# Altium project D_amplifier.PrjPcb (part 3 of 3)

## Sheet power_section.SchDoc
size 431 x 279 mm; Author: Pawel Bukowiec; Organization: ORGANIZATION; Address1: ADDRESS 1; Address2: ADDRESS 2; Address3: ADDRESS 3; Address4: ADDRESS 4; Revision: 1; SheetNumber: 4; SheetTotal: 5; ENG_APP_DATE: --/--/--; DSN_APP_DATE: --/--/--; CHK_APP_DATE: --/--/--; SPICEModelCacheJYBONEFT: <root> / <DocumentId>JYBONEFT</DocumentId> / <CacheFrame Number="0"> / <Model Name="driver_u8_s31" Kind="CKT"> / <Text>*$ / .subckt Driver_U8_S31 1 2 3 4 / S_U8_S31         3 4 1 2 _U8_S31 / RS_U8_S31         1 2 1G / .MODEL         _U8_S31 VSWITCH Roff=10e6 Ron=78m Voff=0.4 Von=1.1 / .ends Driver_U8_S31</Text> / </Model> / <Model Name="srlatchrhp" Kind="CKT"> / <Text>*$ / .SUBCKT SRLATCHRHP S R Q QB PARAMS: VDD=1 VSS=0 VTHRESH=0.5 / EQB 10 0 Value ={ IF( V(R) &gt; 0.6, 1,IF (  V(R)&lt; 0.6 &amp; V(Q)&gt;0.5 , 0 , 1)) } / EQ 20 0 Value ={ IF( V(R) &gt; 0.6, 0, IF ( V(S) &lt; 0.4 &amp; V(QB) &gt; 0.5 , 0 , 1)) } / RD1 10 QB 5 / CD1 QB 0 1E-9 IC = 1 / RD2 20 Q 5 / CD2 Q 0 1E-9 IC=0 / .ENDS SRLATCHRHP</Text> / </Model> / <Model Name="d_nideal" Kind="CKT"> / <Text>*$ / .subckt D_nideal 1 2 / d1 1 3 dd1 / vdc 2 3 1m / .model dd1 d / .ends D_nideal</Text> / </Model> / <Model Name="driver_u8_s4" Kind="CKT"> / <Text>*$ / .subckt Driver_U8_S4 1 2 3 4 / S_U8_S4         3 4 1 2 _U8_S4 / RS_U8_S4         1 2 1G / .MODEL         _U8_S4 VSWITCH Roff=1e6 Ron=2 Voff=0.2 Von=0.8 / .ends Driver_U8_S4</Text> / </Model> / <Model Name="inv_basic_gen" Kind="CKT"> / <Text>*$ / .SUBCKT INV_BASIC_GEN A  Y PARAMS: VDD=1 VSS=0 VTHRESH=0.5 / E_ABMGATE    YINT 0 VALUE {{IF(V(A) &gt; {VTHRESH} , / + {VSS},{VDD})}} / RINT YINT Y 1 / CINT Y 0 1n / .ENDS INV_BASIC_GEN</Text> / </Model> / <Model Name="and3_basic_gen" Kind="CKT"> / <Text>*$ / .SUBCKT AND3_BASIC_GEN A B C Y PARAMS: VDD=1 VSS=0 VTHRESH=0.5 / E_ABMGATE    YINT 0 VALUE {{IF(V(A) &gt; {VTHRESH}  &amp; / + V(B) &gt; {VTHRESH} &amp; / + V(C) &gt; {VTHRESH},{VDD},{VSS})}} / RINT YINT Y 1 / CINT Y 0 1n / .ENDS AND3_BASIC_GEN</Text> / </Model> / <Model Name="and4_basic_gen" Kind="CKT"> / <Text>*$ / .SUBCKT AND4_BASIC_GEN A B C D Y PARAMS: VDD=1 VSS=0 VTHRESH=0.5 / E_ABMGATE    YINT 0 VALUE {{IF(V(A) &gt; {VTHRESH}  &amp; / + V(B) &gt; {VTHRESH} &amp; / + V(C) &gt; {VTHRESH} &amp; / + V(D) &gt; {VTHRESH},{VDD},{VSS})}} / RINT YINT Y 1 / CINT Y 0 1n / .ENDS AND4_BASIC_GEN</Text> / </Model> / <Model Name="buf_delay_basic_gen" Kind="CKT"> / <Text>*$ / .SUBCKT BUF_DELAY_BASIC_GEN A  Y PARAMS: VDD=1 VSS=0 VTHRESH=0.5 DELAY = 10n / E_ABMGATE1    YINT1 0 VALUE {{IF(V(A) &gt; {VTHRESH} , / + {VDD},{VSS})}} / RINT YINT1 YINT2 1 / CINT YINT2 0 {DELAY*1.3} / E_ABMGATE2    YINT3 0 VALUE {{IF(V(YINT2) &gt; {VTHRESH} , / + {VDD},{VSS})}} / RINT2 YINT3 Y 1 / CINT2 Y 0 1n / .ENDS BUF_DELAY_BASIC_GEN</Text> / </Model> / <Model Name="driver_u8_s5" Kind="CKT"> / <Text>*$ / .subckt Driver_U8_S5 1 2 3 4 / S_U8_S5         3 4 1 2 _U8_S5 / RS_U8_S5         1 2 1G / .MODEL         _U8_S5 VSWITCH Roff=1e6 Ron=1.0 Voff=0.2 Von=0.8 / .ends Driver_U8_S5</Text> / </Model> / <Model Name="driver_u8_h2" Kind="CKT"> / <Text>*$ / .subckt Driver_U8_H2 1 2 3 4 / H_U8_H2         3 4 VH_U8_H2 1 / VH_U8_H2         1 2 0V / .ends Driver_U8_H2</Text> / </Model> / <Model Name="and2_basic_gen" Kind="CKT"> / <Text>*$ / .SUBCKT AND2_BASIC_GEN A B Y PARAMS: VDD=1 VSS=0 VTHRESH=0.5 / E_ABMGATE    YINT 0 VALUE {{IF(V(A) &gt; {VTHRESH}  &amp; / + V(B) &gt; {VTHRESH},{VDD},{VSS})}} / RINT YINT Y 1 / CINT Y 0 1n / .ENDS AND2_BASIC_GEN</Text> / </Model> / <Model Name="driver_u8_s30" Kind="CKT"> / <Text>*$ / .subckt Driver_U8_S30 1 2 3 4 / S_U8_S30         3 4 1 2 _U8_S30 / RS_U8_S30         1 2 1G / .MODEL         _U8_S30 VSWITCH Roff=10e6 Ron=148m Voff=0.4 Von=1.1 / .ends Driver_U8_S30</Text> / </Model> / <Model Name="mononeg_ps" Kind="CKT"> / <Text>*$ / .SUBCKT MONONEG_PS in Q Qn PARAMS: PW=1u / VS VSUP 0 DC 1 / GIN VSUP YA VALUE={IF(V(IN)&lt;0.5, V(VSUP)/1000K, 0)} / GDIS YA 0 VALUE={IF(V(IN)&lt;0.5,0, V(YA)/1m)} / CIN YA 0 1n IC=0 / RIN YA 0 1e11 / EABM1 YTD 0 VALUE={IF(V(YA)&gt; {PW*1000}, 0, 1)} / RYTD YTD 0 1e11 / EXOR P 0 VALUE={IF(V(YTD) &gt; 0.5 ^ V(IN) &gt; .5, 1, 0)} / ROUTpp2 P 0 1e11 / EAND1 Q1 0 VALUE={ IF(V(P)&gt;0.5 &amp; V(YTD)&gt;0.5, 1, 0)} / Ro1 Q1 Q 1m / Co1 Q 0 1p IC=0 / ROUT2 Q 0 1e11 / EAND2 Qn1 0 VALUE={ IF(V(Q)&gt;0.5, 0, 1)} / Ro2 Qn1 Qn 1m / Co2 Qn 0 1p / ROUT4 Qn 0 1e11 / .ENDS MONONEG_PS</Text> / </Model> / <Model Name="driver_u8_h1" Kind="CKT"> / <Text>*$ / .subckt Driver_U8_H1 1 2 3 4 / H_U8_H1         3 4 VH_U8_H1 1 / VH_U8_H1         1 2 0V / .ends Driver_U8_H1</Text> / </Model> / <Model Name="driver_u8_s6" Kind="CKT"> / <Text>*$ / .subckt Driver_U8_S6 1 2 3 4 / S_U8_S6         3 4 1 2 _U8_S6 / RS_U8_S6         1 2 1G / .MODEL         _U8_S6 VSWITCH Roff=1e6 Ron=2 Voff=0.2 Von=0.8 / .ends Driver_U8_S6</Text> / </Model> / <Model Name="or3_basic_gen" Kind="CKT"> / <Text>*$ / .SUBCKT OR3_BASIC_GEN A B C Y PARAMS: VDD=1 VSS=0 VTHRESH=0.5 / E_ABMGATE    YINT 0 VALUE {{IF(V(A) &gt; {VTHRESH}  | / + V(B) &gt; {VTHRESH} | / + V(C) &gt; {VTHRESH},{VDD},{VSS})}} / RINT YINT Y 1 / CINT Y 0 1n / .ENDS OR3_BASIC_GEN</Text> / </Model> / <Model Name="driver_u8_s7" Kind="CKT"> / <Text>*$ / .subckt Driver_U8_S7 1 2 3 4 / S_U8_S7         3 4 1 2 _U8_S7 / RS_U8_S7         1 2 1G / .MODEL         _U8_S7 VSWITCH Roff=1e6 Ron=1.0 Voff=0.2 Von=0.8 / .ends Driver_U8_S7</Text> / </Model> / <Model Name="driver_u8_s35" Kind="CKT"> / <Text>*$ / .subckt Driver_U8_S35 1 2 3 4 / S_U8_S35         3 4 1 2 _U8_S35 / RS_U8_S35         1 2 1G / .MODEL         _U8_S35 VSWITCH Roff=1000e6 Ron=1m Voff=0.2 Von=0.8 / .ends Driver_U8_S35</Text> / </Model> / <Model Name="or2_basic_gen" Kind="CKT"> / <Text>*$ / .SUBCKT OR2_BASIC_GEN A B Y PARAMS: VDD=1 VSS=0 VTHRESH=0.5 / E_ABMGATE    YINT 0 VALUE {{IF(V(A) &gt; {VTHRESH}  | / + V(B) &gt; {VTHRESH},{VDD},{VSS})}} / RINT YINT Y 1 / CINT Y 0 1n / .ENDS OR2_BASIC_GEN</Text> / </Model> / <Model Name="inv_delay_basic_gen" Kind="CKT"> / <Text>*$ / .SUBCKT INV_DELAY_BASIC_GEN A  Y PARAMS: VDD=1 VSS=0 VTHRESH=0.5 DELAY = 10n / E_ABMGATE1    YINT1 0 VALUE {{IF(V(A) &gt; {VTHRESH} , / + {VDD},{VSS})}} / RINT YINT1 YINT2 1 / CINT YINT2 0 {DELAY*1.443} / E_ABMGATE2    YINT3 0 VALUE {{IF(V(YINT2) &gt; {VTHRESH} , / + {VSS},{VDD})}} / RINT2 YINT3 Y 1 / CINT2 Y 0 1n / .ENDS INV_DELAY_BASIC_GEN</Text> / </Model> / <Model Name="d_d1" Kind="MDL"> / <Text>*$ / .model D_D1 d / + is=1e-015 / + tt=1e-011 / + rs=0.05 / + n=0.1</Text> / </Model> / <Model Name="dff_r" Kind="CKT"> / <Text>*$ / .SUBCKT DFF_R Q QB CLK D R PARAMS: VDD=1 VSS=0 VTHRESH=0.5 / X1 CLK CLKdel INV_DELAY_BASIC_GEN PARAMS: VDD={VDD} VSS={VSS} VTHRESH={VTHRESH} DELAY = 15n / X2 CLK CLKdel CLKint AND2_BASIC_GEN PARAMS: VDD={VDD} VSS={VSS} VTHRESH={VTHRESH} / GQ 0 Qint VALUE = {IF(V(R) &gt; {VTHRESH},-5,IF(V(CLKint)&gt; {VTHRESH}, / + IF(V(D)&gt; {VTHRESH},5,-5),0))} / CQint Qint 0 1n / RQint Qint 0 1000MEG / D_D10 Qint MY5 D_D1 / V1 MY5 0 {VDD} / D_D11 MYVSS Qint D_D1 / V2 MYVSS 0 {VSS} / EQ Qqq 0 Qint 0 1 / X3 Qqq Qqqd1 BUF_DELAY_BASIC_GEN PARAMS: VDD={VDD} VSS={VSS} VTHRESH={VTHRESH} DELAY = 20n / RQq Qqqd1 Q 1 / EQb Qbr 0 VALUE = {IF( V(Q) &gt; {VTHRESH}, {VSS},{VDD})} / RQb Qbr Qb 1 / Cdummy1 Q 0 1nF / Cdummy2 QB 0 1nF / .IC V(Qint) {VSS} / .ENDS DFF_R</Text> / <Dependency>0\inv_delay_basic_gen</Dependency> / <Dependency>0\and2_basic_gen</Dependency> / <Dependency>0\buf_delay_basic_gen</Dependency> / <Dependency>0\d_d1</Dependency> / </Model> / <Model Name="comp_basic_gen" Kind="CKT"> / <Text>*$ / .SUBCKT COMP_BASIC_GEN INP INM Y PARAMS: VDD=1 VSS=0 VTHRESH=0.5 / E_ABM Yint 0 VALUE {IF (V(INP) &gt; / + V(INM), {VDD},{VSS})} / R1 Yint Y 1 / C1 Y 0 1n / .ENDS COMP_BASIC_GEN</Text> / </Model> / <Model Name="comphys_basic_gen" Kind="CKT"> / <Text>*$ / .SUBCKT COMPHYS_BASIC_GEN INP INM HYS OUT PARAMS: VDD=5 VSS=0 VTHRESH=2.5 / EIN INP1 INM1 INP INM 1 / EHYS INP1 INP2 VALUE { IF( V(1) &gt; {VTHRESH},-V(HYS),0) } / EOUT OUT 0 VALUE { IF( V(INP2)&gt;V(INM1), {VDD} ,{VSS}) } / R1 OUT 1 1 / C1 1 0 5n / RINP1 INP1 0 1K / .ENDS COMPHYS_BASIC_GEN</Text> / </Model> / <Model Name="d_d2" Kind="MDL"> / <Text>*$ / .model D_D2 d / + is=1e-015 / + n=0.1 / + tt=1e-011</Text> / </Model> / <Model Name="hiccup_u10_s5" Kind="CKT"> / <Text>*$ / .subckt Hiccup_U10_S5 1 2 3 4 / S_U10_S5         3 4 1 2 _U10_S5 / RS_U10_S5         1 2 1G / .MODEL         _U10_S5 VSWITCH Roff=1e9 Ron=1.0m Voff=0.25 Von=0.75 / .ends Hiccup_U10_S5</Text> / </Model> / <Model Name="hiccup_u10_s2" Kind="CKT"> / <Text>*$ / .subckt Hiccup_U10_S2 1 2 3 4 / S_U10_S2         3 4 1 2 _U10_S2 / RS_U10_S2         1 2 1G / .MODEL         _U10_S2 VSWITCH Roff=1e6 Ron=1.0 Voff=0.25 Von=0.75 / .ends Hiccup_U10_S2</Text> / </Model> / <Model Name="hiccup_u10_s36" Kind="CKT"> / <Text>*$ / .subckt Hiccup_U10_S36 1 2 3 4 / S_U10_S36         3 4 1 2 _U10_S36 / RS_U10_S36         1 2 1G / .MODEL         _U10_S36 VSWITCH Roff=1G Ron=1.0m Voff=0.2V Von=0.8V / .ends Hiccup_U10_S36</Text> / </Model> / <Model Name="mux2_basic_gen" Kind="CKT"> / <Text>*$ / .SUBCKT MUX2_BASIC_GEN A B S Y PARAMS: VDD=1 VSS=0 VTHRESH=0.5 / E_ABMGATE  YINT 0 VALUE {{IF(V(S) &gt; {VTHRESH}, / + V(B),V(A))}} / RINT YINT Y 1 / CINT Y 0 1n / .ENDS MUX2_BASIC_GEN</Text> / </Model> / <Model Name="oscillator_u3_s26" Kind="CKT"> / <Text>*$ / .subckt Oscillator_U3_S26 1 2 3 4 / S_U3_S26         3 4 1 2 _U3_S26 / RS_U3_S26         1 2 1G / .MODEL         _U3_S26 VSWITCH Roff=100e6 Ron=100m Voff=0.2 Von=0.8 / .ends Oscillator_U3_S26</Text> / </Model> / <Model Name="erroramp_u5_s2" Kind="CKT"> / <Text>*$ / .subckt ErrorAmp_U5_S2 1 2 3 4 / S_U5_S2         3 4 1 2 _U5_S2 / RS_U5_S2         1 2 1G / .MODEL         _U5_S2 VSWITCH Roff=1e9 Ron=1m Voff=0.2 Von=0.5 / .ends ErrorAmp_U5_S2</Text> / </Model> / <Model Name="d_d" Kind="MDL"> / <Text>*$ / .model D_D d / + is=1e-015 / + n=0.01m / + tt=1e-011</Text> / </Model> / <Model Name="softstart_u4_s68" Kind="CKT"> / <Text>*$ / .subckt SoftStart_U4_S68 1 2 3 4 / S_U4_S68         3 4 1 2 _U4_S68 / RS_U4_S68         1 2 1G / .MODEL         _U4_S68 VSWITCH Roff=100e6 Ron=3571 Voff=0.2 Von=0.8 / .ends SoftStart_U4_S68</Text> / </Model> / <Model Name="buf_basic_gen" Kind="CKT"> / <Text>*$ / .SUBCKT BUF_BASIC_GEN A  Y PARAMS: VDD=1 VSS=0 VTHRESH=0.5 / E_ABMGATE    YINT 0 VALUE {{IF(V(A) &gt; {VTHRESH} , / + {VDD},{VSS})}} / RINT YINT Y 1 / CINT Y 0 1n / .ENDS BUF_BASIC_GEN</Text> / </Model> / <Model Name="dffsbrb_rhpbasic_gen" Kind="CKT"> / <Text>*$ / .subckt dffsbrb_rhpbasic_gen q qb clk d rb sb params: vdd=1 vss=0 vthresh=0.5 / x1 clk clkdel inv_delay_basic_gen params: vdd={vdd} vss={vss} vthresh= / + {vthresh} delay = 15n / x2 clk clkdel clkint and2_basic_gen params: vdd={vdd} vss={vss} vthresh= / + {vthresh} / gq 0 qint value = {if(v(rb) &lt; {vthresh},-5,if(v(sb)&lt; {vthresh},5, / +  if(v(clkint)&gt; {vthresh}, / + if(v(d)&gt; {vthresh},5,-5),0)))} / cqint qint 0 1n / rqint qint 0 1000meg / d_d10 qint my5 d_d1 / v1 my5 0 5 / d_d11 0 qint d_d1 / eq qqq 0 qint 0 1 / x3 qqq qqqd1 buf_delay_basic_gen params: vdd={vdd} vss={vss} vthresh={vthresh} / +  delay = 20n / rqq qqqd1 q 1 / eqb qbr 0 value = {if( v(q) &gt; {vthresh}, {vss},{vdd})} / rqb qbr qb 1 / cdummy1 q 0 1nf / cdummy2 qb 0 1nf / .ic v(qint) {vss} / .model d_d1 d / + is=1e-015 / + tt=1e-011 / + rs=0.05 / + n=0.1 / .ends dffsbrb_rhpbasic_gen</Text> / <Dependency>0\inv_delay_basic_gen</Dependency> / <Dependency>0\and2_basic_gen</Dependency> / <Dependency>0\buf_delay_basic_gen</Dependency> / </Model> / <Model Name="gmiphase_u6_s2" Kind="CKT"> / <Text>*$ / .subckt GmIphase_U6_S2 1 2 3 4 / S_U6_S2         3 4 1 2 _U6_S2 / RS_U6_S2         1 2 1G / .MODEL         _U6_S2 VSWITCH Roff=1e9 Ron=1.0m Voff=0.25 Von=0.75 / .ends GmIphase_U6_S2</Text> / </Model> / <Model Name="tps54202h_trans" Kind="CKT"> / <Text>*$ / *TPS54202H / ***************************************************************************** / * (C) Copyright 2016 Texas Instruments Incorporated. All rights reserved. / ***************************************************************************** / ** This model is designed as an aid for customers of Texas Instruments. / ** TI and its licensors and suppliers make no warranties, either expressed / ** or implied, with respect to this model, including the warranties of / ** merchantability or fitness for a particular purpose.  The model is / ** provided solely on an "as is" basis.  The entire risk as to its quality / ** and performance is with the customer / ***************************************************************************** / * / * This model is subject to change without notice. Texas Instruments / * Incorporated is not responsible for updating this model. / * / ***************************************************************************** / * / ** Released by: WEBENCH Design Center, Texas Instruments Inc. / * Part: TPS54202H / * Date: 19APR2016 / * Model Type:  TRANSIENT / * Simulator: PSPICE / * Simulator Version: 16.2.0.p001 / * EVM Order Number: NA / * EVM Users Guide: NA / * Datasheet: NA / * / * Model Version: Final 1.00 / * / ***************************************************************************** / * / * Updates: / * / * Final 1.00 / * Release to Web. / * / ***************************************************************************** / * / * Model Usage Notes: / * / * 1. All the features mentioned in the datasheet have been modelled except / *      a. Thermal behaviour / * / * / ***************************************************************************** / .SUBCKT TPS54202H_TRANS BOOT EN GND PH VIN VSENSE PARAMS: STEADY_STATE=0 / R_U8_R245         0 BOOT  10Meg / X_U8_S31    LDRV 0 PH U8_N16881733 Driver_U8_S31 / C_U8_C78         U8_N16881752 0  1.443n / E_U8_ABM170         U8_N16882064 0 VALUE { {IF(V(LDRV) &gt; 1.1,0,1)}    } / X_U8_S4    LDRVIN 0 U8_N16881594 LDRV Driver_U8_S4 / X_U8_U621         PWM_FINAL U8_N16881765 INV_BASIC_GEN PARAMS: VDD=1 VSS=0 / +  VTHRESH=500E-3 / X_U8_U619         U8_SDWN_N PWM_FINAL U8_N16882062 HDRVIN AND3_BASIC_GEN / +  PARAMS: VDD=1 VSS=0 VTHRESH=500E-3 / E_U8_ABM79         U8_N16881756 0 VALUE { {IF((V(HDRV) - V(PH)) &gt; 1.1,0,1)} / +  } / X_U8_U613         SDWN U8_SDWN_N INV_BASIC_GEN PARAMS: VDD=1 VSS=0 / +  VTHRESH=500E-3 / X_U8_S5    U8_N16881411 0 LDRV 0 Driver_U8_S5 / X_U8_U622         U8_SDWN_N U8_N16881765 OCLOWLIMIT U8_N16881752 U8_BOOT_ON / +  AND4_BASIC_GEN PARAMS: VDD=1 VSS=0 VTHRESH=500E-3 / C_U8_C77         U8_N16882062 0  1.443n / R_U8_R143         U8_N16882064 U8_N16882062  35 / X_U8_H2    U8_N16881733 0 OCLOW 0 Driver_U8_H2 / V_U8_V49         U8_N16881594 0 5 / X_U8_D15         PH U8_N16881320 D_nideal / X_U8_U827         U8_BOOT_ON PBIAS LDRVIN AND2_BASIC_GEN PARAMS: VDD=1 VSS=0 / +  VTHRESH=500E-3 / E_U8_ABM167         U8_N16881692 0 VALUE { {IF((V(BOOT) - V(PH)) &lt; 2.1,0,1)} / +  } / C_U8_C140         0 BOOT_UVLO  1n / X_U8_S30    HDRV PH U8_N16881320 PH Driver_U8_S30 / X_U8_U617         HDRVIN U8_N16881438 INV_BASIC_GEN PARAMS: VDD=1 VSS=0 / +  VTHRESH=500E-3 / X_U8_H1    VIN U8_N16881320 ISW 0 Driver_U8_H1 / X_U8_S6    HDRVIN 0 BOOT HDRV Driver_U8_S6 / R_U8_R144         U8_N16881756 U8_N16881752  35 / X_U8_S7    U8_N16881438 0 HDRV PH Driver_U8_S7 / X_U8_D16         U8_N16881733 PH D_nideal / X_U8_S35    U8_BOOT_ON 0 VIN BOOT Driver_U8_S35 / R_U8_R244         U8_N16881692 BOOT_UVLO  1 / X_U8_U616         LDRVIN U8_N16881411 INV_BASIC_GEN PARAMS: VDD=1 VSS=0 / +  VTHRESH=500E-3 / X_U12_U613         U12_N16779597 HDRV U12_VALLEY_ILIMIT OR2_BASIC_GEN PARAMS: / +  VDD=1 VSS=0 VTHRESH=500E-3 / E_U12_ABM154         U12_N16766365 0 VALUE { IF(V(SS_TR)&lt;30m,1,V(HDRVIN))    } / X_U12_U646         OCLOWLIMIT U12_N16760921 U12_N16760925 U12_SET1 / +  U12_N16760761 DFF_R PARAMS:  VDD=1 VSS=0 VTHRESH=0.5 / X_U12_U647         SYSCLK U12_N16766365 U12_N16760925 AND2_BASIC_GEN PARAMS: / +  VDD=1 VSS=0 VTHRESH=500E-3 / V_U12_V84         U12_SET1 0 1 / R_U12_R3         0 U12_N16760921  10k / X_U12_U605         U12_N16779389 ISW U12_CBC_ILIMIT COMP_BASIC_GEN PARAMS: / +  VDD=1 VSS=0 VTHRESH=0.5 / E_U12_ABM153         U12_N16775618 0 VALUE { {IF(V(LDRVIN) &gt; 0.5, {IF(V(OCLOW) / +  &gt; -50m,1,0)},0)}    } / X_U12_U621         U12_CBC_ILIMIT U12_VALLEY_ILIMIT U12_N16779301 ILIM / +  AND3_BASIC_GEN PARAMS: VDD=1 VSS=0 VTHRESH=500E-3 / R_U12_R2         U12_N16775618 U12_N16760761  1 / X_U12_U611         OCLOW U12_N16779415 U12_N16779597 COMP_BASIC_GEN PARAMS: / +  VDD=1 VSS=0 VTHRESH=0.5 / X_U12_U620         HICCUP U12_N16779301 INV_BASIC_GEN PARAMS: VDD=1 VSS=0 / +  VTHRESH=500E-3 / C_U12_C2         U12_N16760761 0  1n / V_U12_VOCLLM         U12_N16779415 0 -3.2 / V_U12_VOCHLM         U12_N16779389 0 3.4 / X_U11_U136         U11_N16496294 U11_N6045102 SDWN OR2_BASIC_GEN PARAMS: VDD=1 / +  VSS=0 VTHRESH=500E-3 / X_U11_U2         EN U11_N16640225 U11_N166402810 U11_ENAB COMPHYS_BASIC_GEN / +  PARAMS: VDD=1 VSS=0 VTHRESH=0.5 / V_U11_V64         U11_N16643747 0 4.2 / D_U11_D12         0 EN D_D2 / V_U11_V66         U11_N16655865 0 6.5V / G_U11_ABMII1         VIN EN VALUE { {0+ 1.1u*V(U11_ENAB)}    } / V_U11_V65         U11_N16642234 0 0.5 / X_U11_U605         U11_ENAB U11_N16496294 INV_BASIC_GEN PARAMS: VDD=1 VSS=0 / +  VTHRESH=500E-3 / X_U11_U604         U11_N166419402 U11_N6045102 INV_BASIC_GEN PARAMS: VDD=1 / +  VSS=0 VTHRESH=500E-3 / X_U11_U3         VIN U11_N16643747 U11_N16642234 U11_N166419402 / +  COMPHYS_BASIC_GEN PARAMS: VDD=1 VSS=0 VTHRESH=0.5 / R_U11_R257         0 EN  1Meg / V_U11_V1         U11_N166402810 0 0.3Vdc / D_U11_D11         EN U11_N16655865 D_D2 / V_U11_V2         U11_N16640225 0 1.28Vdc / D_U11_D9         EN VIN D_D2 / G_U10_G5         0 U10_N16878554 U10_500N 0 1 / G_U10_G3         0 U10_N16864691 U10_OUT2 0 1 / X_U10_U652         U10_N16864713 U10_N16864533 INV_BASIC_GEN PARAMS: VDD=1 / +  VSS=0 VTHRESH=500E-3 / X_U10_S5    U10_N16878651 0 U10_N16878554 0 Hiccup_U10_S5 / V_U10_V48         U10_N16854825 0 12 / X_U10_U614         U10_N16864713 SYSCLK U10_HICCUP_N U10_OUT1 AND3_BASIC_GEN / +  PARAMS: VDD=1 VSS=0 VTHRESH=500E-3 / D_U10_D14         U10_H_CHECK U10_N16854825 D_D2 / C_U10_C1         0 U10_N16864691  500n IC=0 / X_U10_U650         SYSCLK U10_500N N16878734 MONONEG_PS PARAMS: PW=500N / X_U10_S2    U10_N16864770 0 U10_N16864691 0 Hiccup_U10_S2 / X_U10_U615         U10_N16864543 U10_N16864560 U10_N16864770 OR2_BASIC_GEN / +  PARAMS: VDD=1 VSS=0 VTHRESH=500E-3 / I_U10_I3         U10_N16854825 U10_H_CHECK DC 5u / X_U10_U622         U10_CLR_HICCUP U10_N16880073 U10_N16864560 OR2_BASIC_GEN / +  PARAMS: VDD=1 VSS=0 VTHRESH=500E-3 / X_U10_U607         HICCUP U10_N16864664 INV_DELAY_BASIC_GEN PARAMS: VDD=1 VSS=0 / +  VTHRESH=0.5 DELAY=10u / X_U10_U613         SDWN U10_H_END U10_N16864651 OR2_BASIC_GEN PARAMS: VDD=1 / +  VSS=0 VTHRESH=500E-3 / X_U10_S36    U10_N16854816 0 U10_H_CHECK 0 Hiccup_U10_S36 / X_U10_U608         HICCUP U10_N16864664 U10_N16864552 AND2_BASIC_GEN PARAMS: / +  VDD=1 VSS=0 VTHRESH=500E-3 / X_U10_U617         U10_N16864604 U10_N16864552 U10_N16880073 OR2_BASIC_GEN / +  PARAMS: VDD=1 VSS=0 VTHRESH=500E-3 / V_U10_V2         U10_N16864680 0 512 / R_U10_R4         U10_N16864713 U10_N16864539  8k / X_U10_U625         U10_N16878554 U10_N16878597 U10_CLR_HICCUP COMP_BASIC_GEN / +  PARAMS: VDD=1 VSS=0 VTHRESH=0.5 / X_U10_U618         HICCUP U10_N16854816 INV_DELAY_BASIC_GEN PARAMS: VDD=1 VSS=0 / +  VTHRESH=0.5 DELAY=20n / X_U10_U609         U10_N16864691 U10_N16864680 U10_N16864671 COMP_BASIC_GEN / +  PARAMS: VDD=1 VSS=0 VTHRESH=0.5 / C_U10_C5         U10_N16864539 0  1.443n / E_U10_ABM171         U10_N16878651 0 VALUE { if(v(HDRVIN) &gt;0.5 , 0 , 1 )    } / X_U10_U616         U10_N16864539 U10_N16864533 U10_N16864543 AND2_BASIC_GEN / +  PARAMS: VDD=1 VSS=0 VTHRESH=500E-3 / D_U10_D15         U10_N16878554 U10_N16878590 D_D2 / C_U10_C83         U10_H_CHECK 0  1.6384E-08 IC=0 / D_U10_D10         U10_N16864691 U10_N16864688 D_D2 / X_U10_U619         U10_H_CHECK U10_N16855026 U10_N16854953 COMP_BASIC_GEN / +  PARAMS: VDD=1 VSS=0 VTHRESH=0.5 / X_U10_U30         U10_N16864671 U10_N16864651 HICCUP U10_HICCUP_N SRLATCHRHP / +  PARAMS: VDD=1 VSS=0 VTHRESH=0.5 / V_U10_V5         U10_N16864604 0 / +PULSE {STEADY_STATE} 0 0 1n 1n 200u 1 / E_U10_ABM1         U10_N16864713 0 VALUE { IF( V(OCB) &gt; 0.5 , 1 , 0 )    } / V_U10_V9         U10_N16878590 0 5 / X_U10_U620         U10_N16854953 U10_N16854955 U10_H_END AND2_BASIC_GEN PARAMS: / +  VDD=1 VSS=0 VTHRESH=500E-3 / V_U10_V1         U10_N16864688 0 515 / V_U10_V10         U10_N16878597 0 3.98 / X_U10_U621         U10_N16854953 U10_N16854955 INV_DELAY_BASIC_GEN PARAMS: / +  VDD=1 VSS=0 VTHRESH=0.5 DELAY=10u / C_U10_C3         0 U10_N16878554  500n IC=0 / V_U10_V6         U10_N16855026 0 10 / X_U10_U648         U10_OUT1 U10_OUT2 N16864942 MONONEG_PS PARAMS: PW=500N / R_R275         VSENSE VSENSE_INT  400k / C_C12         0 VSENSE_INT  2p / X_U3_U137         U3_CLK_500K U3_ULQ_CLK ULQ_MODE SYSCLK MUX2_BASIC_GEN PARAMS: / +  VDD=1 VSS=0 VTHRESH=0.5 / D_U3_D11         RAMP U3_N16804971 D_D2 / V_U3_V45         U3_N16804971 0 5 / V_U3_V47         U3_ULQ_CLK 0 / +PULSE 0 1 0 1n 1n 12.5u 25u / C_U3_C1         0 U3_BLANK  1.443n / V_U3_VRAMP_MAX         U3_N16692390 0 1.4 / X_U3_U135         U3_CLK_500K U3_N16810628 BUF_DELAY_BASIC_GEN PARAMS: VDD=1 / +  VSS=0 VTHRESH=0.5 DELAY=20n / X_U3_U131         RAMP U3_N16692390 U3_CLK_500K COMP_BASIC_GEN PARAMS: VDD=1 / +  VSS=0 VTHRESH=0.5 / D_U3_D12         U3_N16817384 U3_BLANK D_D2 / X_U3_S26    U3_N16807586 0 RAMP 0 Oscillator_U3_S26 / E_U3_E1         U3_N16817384 0 ULQ_MODE 0 1 / G_U3_ABMII1         U3_N16804971 RAMP VALUE { V(0) + 5u    } / X_U3_U136         SDWN U3_BLANK U3_N16810628 U3_N16807586 OR3_BASIC_GEN PARAMS: / +  VDD=1 VSS=0 VTHRESH=500E-3 / C_U3_CRAMP         RAMP 0  7.143p / R_U3_R1         U3_N16817384 U3_BLANK  1k / C_U5_C8         0 N16888001  2p / R_U5_R6         U5_N16755015 N16888001  15k / V_U5_Vupper_CLMP         U5_N16757488 0 2.3 / C_U5_C11         0 OCB  1n / X_U5_S2    ULQ_MODE 0 N16888001 U5_N16739044 ErrorAmp_U5_S2 / C_U5_C7         0 U5_N16739044  18p / D_U5_D10         N16888001 U5_N16757488 D_D / R_U5_Ro         0 N16888001  4MEG / E_U5_ABM10         U5_TAIL_CUR 0 VALUE { {IF(V(ULQ_MODE) &gt; 0.5 , 2u , 40u)} / +  } / D_U5_D9         U5_LOW_CLMP N16888001 D_D / R_U5_R12         U5_N7406885 OCB  1 / G_U5_ABM2I3         U5_N16755015 0 VALUE { / +  LIMIT((V(U5_N16755015)-V(U5_N16739044))*66u , -V(U5_GM), V(U5_GM) )    } / R_U5_R274         U5_N16739044 U5_N16755015  1.875Meg / E_U5_ABM8         U5_N7406885 0 VALUE { {IF(V(N16888001) &gt; 1.75,5,0)}    } / E_U5_ABM9         U5_LOW_CLMP 0 VALUE { {IF(V(SDWN) &gt; 0.5,0,0.439)}    } / G_U5_ABM2I1         0 N16888001 VALUE { {LIMIT((V(VREF_GM) - / +  V(VSENSE_INT))*200u, -V(U5_TAIL_CUR),V(U5_TAIL_CUR))}    } / E_U5_ABM169         U5_GM 0 VALUE { {IF(V(ULQ_MODE) &gt; 0.5 , 0 , 20u)}    } / X_U4_U825         SDWN OCB HICCUP U4_N16681297 OR3_BASIC_GEN PARAMS: VDD=1 / +  VSS=0 VTHRESH=500E-3 / G_U4_ABMII1         U4_N7397984 SS_TR VALUE { {IF(V(U4_N16678220) &gt; / +  0.5,0.18u,0)}    } / V_U4_V70         U4_N7397984 0 1.7 / R_U4_R15         U4_N16681297 U4_N16681349  100 / X_U4_S68    U4_N16681349 0 SS_TR U4_N16681263 SoftStart_U4_S68 / V_U4_V72         U4_N16681263 0 -0.1mVdc / X_U4_U827         U4_HICCUP_N U4_N16661855 U4_N16678220 AND2_BASIC_GEN PARAMS: / +  VDD=1 VSS=0 VTHRESH=500E-3 / D_U4_D63         0 SS_TR D_D2 / E_U4_ABM174         VREF_GM 0 VALUE { IF( {STEADY_STATE} &gt; 0.5, 0.6, / +  IF(V(SS_TR) &lt; 600m, V(SS_TR),600m))    } / C_U4_C15         0 U4_N16681349  1.443n / X_U4_U1         SDWN U4_N16661855 INV_BASIC_GEN PARAMS: VDD=1 VSS=0 / +  VTHRESH=500E-3 / D_U4_D62         SS_TR U4_N7397984 D_D2 / X_U4_U2         HICCUP U4_HICCUP_N INV_BASIC_GEN PARAMS: VDD=1 VSS=0 / +  VTHRESH=500E-3 / C_U4_C9         SS_TR 0  1.5n IC={1.7*STEADY_STATE} / V_V1         N16888001 COMP 0Vdc / X_U6_U823         U6_N17090706 U6_PWM_CLK U6_N17026806 AND2_BASIC_GEN PARAMS: / +  VDD=1 VSS=0 VTHRESH=500E-3 / D_U6_D59         U6_DISABLE U6_N17027128 D_D2 / V_U6_V85         U6_N17027150 VSENSE_INT 10m / X_U6_U828         U6_N17096258 SYSCLK U6_N17108478 AND2_BASIC_GEN PARAMS: VDD=1 / +  VSS=0 VTHRESH=500E-3 / X_U6_U630         COMP U6_N17162707 U6_N17152306 COMP_BASIC_GEN PARAMS: VDD=1 / +  VSS=0 VTHRESH=0.5 / X_U6_U612         U6_N17026579 VSENSE_INT PBIAS COMP_BASIC_GEN PARAMS: VDD=1 / +  VSS=0 VTHRESH=0.5 / R_U6_R257         SYSCLK U6_N17027029  20 / D_U6_D13         ULQ_MODE_PRE U6_N17140876 D_D2 / X_U6_U623         U6_N17096095 U6_N17096138 ULQ_MODE_PRE COMP_BASIC_GEN PARAMS: / +  VDD=1 VSS=0 VTHRESH=0.5 / R_U6_R255         U6_N17026611 U6_N17026643  90 / X_U6_U632         U6_S_HIGH U6_2 U6_N17027085 AND2_BASIC_GEN PARAMS: VDD=1 / +  VSS=0 VTHRESH=500E-3 / C_U6_C148         0 U6_N17027029  1.443n / D_U6_D60         SYSCLK U6_N17027029 D_D1 / X_U6_U829         U6_N17140876 ULQ_MODE BUF_BASIC_GEN PARAMS: VDD=1 VSS=0 / +  VTHRESH=0.5 / E_U6_ABM151         U6_N17026611 0 VALUE { {IF(V(HDRVIN) &gt; 0.5, 1,0)}    } / C_U6_C147         U6_DISABLE 0  1n / D_U6_D10         U6_N17108478 U6_N17096275 D_D / D_U6_D12         U6_N17096095 U6_N17096122 D_D2 / X_U6_U629         VREF_GM U6_N17027150 U6_S_HIGH COMP_BASIC_GEN PARAMS: VDD=1 / +  VSS=0 VTHRESH=0.5 / C_U6_C146         0 U6_N17026643  1.443n / E_U6_ABM171         U6_N17096178 0 VALUE { {IF(V(SS_TR) &lt; 1.4 | / +  V(U6_SKIP_MODEB) &gt; 0.5, 1 , 0)}    } / E_U6_E1         U6_N17152274 0 U6_SKIP_MODEB 0 -10m / V_U6_V7         U6_N17096122 0 5 / C_U6_C174         0 U6_N17096275  1.443n / E_U6_ABM152         U6_ISWF 0 VALUE { {IF(V(U6_N17026643) &gt; 0.5, V(ISW), -50)} / +    } / V_U6_V46         U6_SET1 0 1 / X_U6_U2         COMP U6_N17027502 U6_N17027443 U6_N17027128 COMPHYS_BASIC_GEN / +  PARAMS: VDD=1 VSS=0 VTHRESH=0.5 / X_U6_U634         U6_CTRL U6_SLEEP_N U6_SKIP_N AND2_BASIC_GEN PARAMS: VDD=1 / +  VSS=0 VTHRESH=500E-3 / X_U6_U603         U6_PWM_CLK N17026674 SYSCLK U6_SET1 U6_CLK_LOW U6_SET1 / +  dffsbrb_rhpbasic_gen PARAMS: VDD=1 VSS=0 VTHRESH=500E-3 / V_U6_V8         U6_N17096138 0 3.98 / V_U6_V87         U6_N17027443 0 10m / E_U6_ABM153         U6_ICTRL 0 VALUE { (((((V(COMP)/112.5k) / +  -3u)*4)-V(U6_ISLOPE))*12-8u)*16000    } / X_U6_U628         VREF_GM VSENSE_INT U6_HIGH COMP_BASIC_GEN PARAMS: VDD=1 VSS=0 / +  VTHRESH=0.5 / R_U6_R276         U6_N17152306 U6_N17152310  1k / D_U6_D58         U6_N17026643 U6_N17026611 D_D1 / R_U6_R273         U6_N17027461 U6_N17027477  1 / X_U6_U609         U6_SKIP_N ILIM U6_OVP BOOT_UVLO U6_CLK_LOW AND4_BASIC_GEN / +  PARAMS: VDD=1 VSS=0 VTHRESH=500E-3 / C_U6_C176         0 U6_N17152310  1.443n / C_U6_C2         0 U6_CLK1  1n / V_U6_V89         U6_N17162707 U6_N17152274 450m / C_U6_C173         0 U6_N17027477  1n / C_U6_C1         0 U6_N17096095  500n IC=0 / E_U6_ABM165         U6_N17027461 0 VALUE { IF(V(U6_DISABLE)&lt;0.5 &amp; V(SS_TR)&lt;1.4, / +  V(SYSCLK), 0)    } / E_U6_ABM5         U6_ISLOPE_INT 0 VALUE { MAX(V(RAMP)-0.3,0)*16u    } / D_U6_D16         U6_N17152306 U6_N17152310 D_D2 / V_U6_VOVP_THRESH         U6_N17026546 0 0.648 / X_U6_U631         U6_N17027498 U6_HIGH U6_N17027087 AND2_BASIC_GEN PARAMS: / +  VDD=1 VSS=0 VTHRESH=500E-3 / X_U6_U648         U6_N17027477 U6_CLK N17027239 MONONEG_PS PARAMS: PW=200N / X_U6_U3         U6_N17026546 VSENSE_INT U6_N17026548 U6_OVP COMPHYS_BASIC_GEN / +  PARAMS: VDD=1 VSS=0 VTHRESH=0.5 / R_U6_R2         U6_CLK U6_CLK1  216.45 / X_U6_U646         U6_N17027351 N17027164 U6_CLK1 PH SDWN DFF_R PARAMS:  VDD=1 / +  VSS=0 VTHRESH=0.5 / V_U6_VOVP_HYS         U6_N17026548 0 0.024 / V_U6_V88         U6_N17027502 0 0.45 / G_U6_G3         0 U6_N17096095 U6_500N 0 1 / C_U6_C3         0 U6_N17027268  1n / X_U6_U30         U6_N17027029 SYSCLK U6_SLOPE_EN N17027039 SRLATCHRHP PARAMS: / +  VDD=1 VSS=0 VTHRESH=0.5 / X_U6_U831         U6_N17152310 U6_SKIP_MODEB BUF_BASIC_GEN PARAMS: VDD=1 VSS=0 / +  VTHRESH=0.5 / V_U6_V86         U6_N17026579 SS_TR 20m / R_U6_R272         U6_N17026806 U6_INDELAYED1  95 / X_U6_U643         U6_SKIP_MODEB U6_N17027085 U6_N17027087 U6_N17027096 / +  OR3_BASIC_GEN PARAMS: VDD=1 VSS=0 VTHRESH=500E-3 / R_U6_R3         U6_CLK U6_N17027268  173.16 / E_U6_ABM170         U6_SLEEP_N 0 VALUE { {IF(V(SS_TR) &gt; / +  1.4,V(U6_SKIP_MODEB),V(U6_N17027096))}    } / X_U6_S2    U6_N17096178 0 U6_N17096095 0 GmIphase_U6_S2 / R_U6_R275         ULQ_MODE_PRE U6_N17140876  2k / X_U6_U822         U6_PWM_CLK U6_N17090706 INV_DELAY_BASIC_GEN PARAMS: VDD=1 / +  VSS=0 VTHRESH=0.5 DELAY=15n / E_U6_ABM6         U6_ISLOPE 0 VALUE { IF( V(U6_SLOPE_EN) &gt; 0.5 , / +  V(U6_ISLOPE_INT) , 0)    } / R_U6_R256         U6_N17027128 U6_DISABLE  144k / X_U6_U600         U6_ICTRL U6_ISWF U6_CTRL COMP_BASIC_GEN PARAMS: VDD=1 VSS=0 / +  VTHRESH=0.5 / X_U6_U824         U6_N17026806 U6_INDELAYED1 U6_PWM_CLK PWM_FINAL OR3_BASIC_GEN / +  PARAMS: VDD=1 VSS=0 VTHRESH=500E-3 / C_U6_C175         0 U6_N17140876  1.443n / R_U6_R274         U6_N17108478 U6_N17096275  470 / X_U6_U647         U6_2 U6_N17027498 U6_N17027268 U6_N17027351 SDWN DFF_R / +  PARAMS:  VDD=1 VSS=0 VTHRESH=0.5 / E_U6_ABM169         U6_500N 0 VALUE { if(V(U6_N17096275) &gt;0.5, 1 , 0)    } / D_U6_D9         U6_N17026806 U6_INDELAYED1 D_D / X_U6_U827         SYSCLK U6_N17096258 INV_DELAY_BASIC_GEN PARAMS: VDD=1 VSS=0 / +  VTHRESH=0.5 DELAY=30n / C_U6_C172         0 U6_INDELAYED1  1.443n / .IC         V(EN )=0 / .ENDS TPS54202H_TRANS</Text> / <Dependency>0\driver_u8_s31</Dependency> / <Dependency>0\srlatchrhp</Dependency> / <Dependency>0\d_nideal</Dependency> / <Dependency>0\driver_u8_s4</Dependency> / <Dependency>0\inv_basic_gen</Dependency> / <Dependency>0\and3_basic_gen</Dependency> / <Dependency>0\and4_basic_gen</Dependency> / <Dependency>0\buf_delay_basic_gen</Dependency> / <Dependency>0\driver_u8_s5</Dependency> / <Dependency>0\driver_u8_h2</Dependency> / <Dependency>0\and2_basic_gen</Dependency> / <Dependency>0\driver_u8_s30</Dependency> / <Dependency>0\mononeg_ps</Dependency> / <Dependency>0\driver_u8_h1</Dependency> / <Dependency>0\driver_u8_s6</Dependency> / <Dependency>0\or3_basic_gen</Dependency> / <Dependency>0\driver_u8_s7</Dependency> / <Dependency>0\driver_u8_s35</Dependency> / <Dependency>0\or2_basic_gen</Dependency> / <Dependency>0\dff_r</Dependency> / <Dependency>0\inv_delay_basic_gen</Dependency> / <Dependency>0\comp_basic_gen</Dependency> / <Dependency>0\comphys_basic_gen</Dependency> / <Dependency>0\d_d2</Dependency> / <Dependency>0\hiccup_u10_s5</Dependency> / <Dependency>0\hiccup_u10_s2</Dependency> / <Dependency>0\hiccup_u10_s36</Dependency> / <Dependency>0\mux2_basic_gen</Dependency> / <Dependency>0\oscillator_u3_s26</Dependency> / <Dependency>0\erroramp_u5_s2</Dependency> / <Dependency>0\d_d</Dependency> / <Dependency>0\d_d1</Dependency> / <Dependency>0\softstart_u4_s68</Dependency> / <Dependency>0\buf_basic_gen</Dependency> / <Dependency>0\dffsbrb_rhpbasic_gen</Dependency> / <Dependency>0\gmiphase_u6_s2</Dependency> / </Model> / <Model Name="ldo_basic" Kind="CKT"> / <Text>*$ / .SUBCKT ldo_basic out vgnd vin bias enb fbk / + PARAMS: / + rinp = 1e07 / + rout = 0.1 / + psrr = 5e-4 / + pole = 100 / + zero = 10e3 / + venb = 1.0 / + ehys = 0.1 / + uvlo = 2.0 / + uhys = 0.1 / + vref = 1.20 / + drop = 0.25 / + ilim = 0.10 / + ttrn = 1e-4 / R00 vin vxx  { rinp } / C00 vin vxx  { 1/(6.28*rinp*pole) } / EX1 vx1   0 VALUE {IF(V(enb, vgnd) + V(egd)*ehys &gt; venb, 1, 0)} / RX1 vx1 egd 10 / CX1 egd   0 1n / EX2 vx2   0 VALUE {IF(V(bias, vgnd) + V(vgd)*uhys &gt; uvlo, 1, 0)} / RX2 vx2 vgd 10 / CX2 vgd   0 1n / E01 v01 vgnd VALUE { / + IF(V(egd)&gt;0.51&amp;V(vgd)&gt;0.51, { vref }, 0) } / R01 v01 ref {3.333e5*SQRT(ttrn)} / C01 ref vgnd {1e-6*SQRT(ttrn)} / E02 v02   0  VALUE { / + V(ref)*(ABS(V(out)) + 1E-6)/(ABS(V(fbk)) + 1E-6) } / R02 v02 des 10 / C02 des   0 1n / E03 drv   0 VALUE { / + MIN(V(des), MAX(V(vin)-drop, 0))} / R03 drv vxx { psrr*rinp } / C03 drv vxx { 1/(6.28*psrr*rinp*zero) } / E04 vyy   0  VALUE { / + MIN(V(vxx), V(vzz) + ilim*rout) } / R04 vyy vzz { rout } / F04 vin vyy V04 1 / V04 vzz out 0V / .ENDS ldo_basic</Text> / </Model> / <Model Name="lp2985-50" Kind="CKT"> / <Text>.SUBCKT LP2985-50 VIN GND ON_OFF BYPASS VOUT / X1  VOUT GND VIN VIN ON_OFF FBK_INT  LDO_BASIC / + PARAMS: / + rinp = 1.000e+7 / + rout = 2.000e-2 / + psrr = 3.162e-3 / + pole = 3.000e+3 / + zero = 6.000e+4 / + venb = 1.400e+0 / + ehys = 2.000e-1 / + uvlo = 1.600e+0 / + uhys = 1.000e-1 / + vref = 1.230e+0 / + drop = 2.000e-1 / + ilim = 3.500e-1 / + ttrn = 1.000e-4 / R1  VOUT FBK_INT  3.770MEG / R2  FBK_INT GND 1.230MEG / R6  BYPASS GND 10MEG / .ENDS LP2985-50</Text> / <Dependency>0\ldo_basic</Dependency> / </Model> / </CacheFrame> / </root>
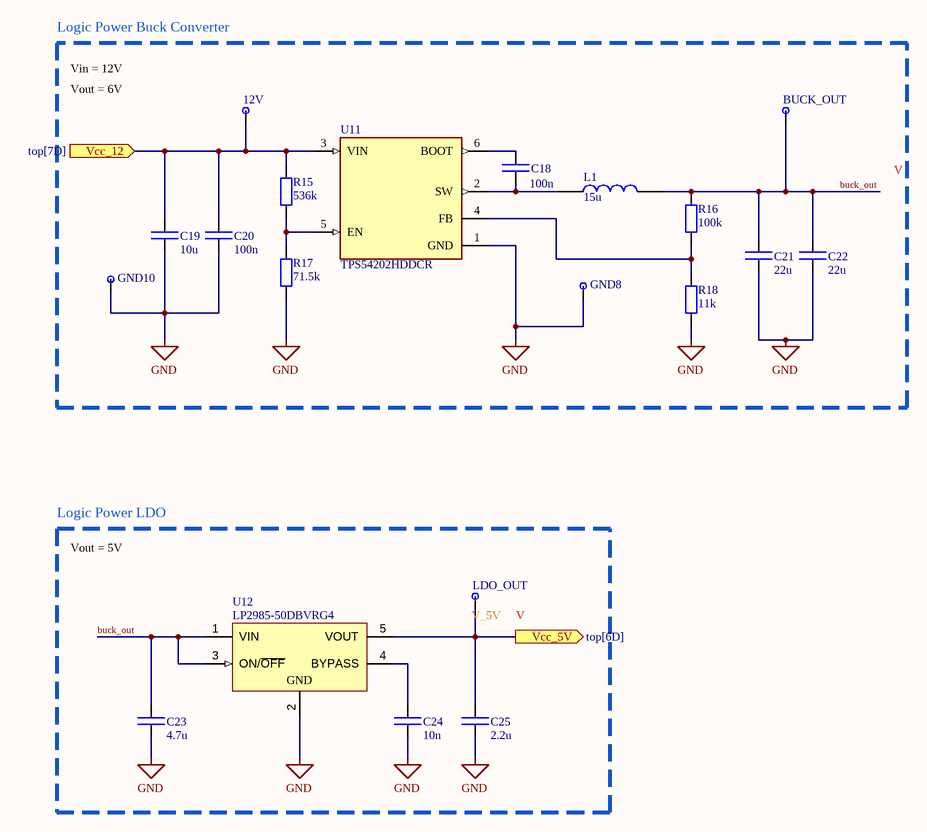
[diagram p4: power_section.SchDoc]

### Parts
12V  TestPoint  [TestPoint_SMT]  (value not drawn)
BUCK_OUT  TestPoint  [TestPoint_SMT]  (value not drawn)
C18  100n  [CAP_IPC_0805_133A]
C19  10u  [CAP_IPC_0805_133A]
C20  100n  [CAP_IPC_0805_133A]
C21  22u  [CAP_IPC_0805_133A]
C22  22u  [CAP_IPC_0805_133A]
C23  4.7u  [CAP_IPC_0805_133A]
C24  10n  [CAP_IPC_0805_133A]
C25  2.2u  [CAP_IPC_0805_133A]
GND8  TestPoint  [TestPoint_SMT]  (value not drawn)
GND10  TestPoint  [TestPoint_SMT]  (value not drawn)
L1  value 15u  [INDPM7373X455N]  (hidden comment: 46153C)
LDO_OUT  TestPoint  [TestPoint_SMT]  (value not drawn)
R15  536k  [RES_VJ_0402_MD]
R16  100k  [RES_VJ_0402_MD]
R17  71.5k  [RES_VJ_0402_MD]
R18  11k  [RES_VJ_0402_MD]
U11  TPS54202HDDCR  [TPS54202HDDCR]
U12  LP2985-50DBVRG4  [LP2985-50DBVRG4]

### Blocks framed on the sheet
Logic Power Buck Converter: 12V BUCK_OUT C18-C22 GND8 GND10 L1 R15-R18 U11
Logic Power LDO: C23-C25 LDO_OUT U12

### Ports
Vcc_5V (out, see top[6D]), Vcc_12 (in, see top[7D])

### Nets
5V: C25.1 LDO_OUT.1 U12.5(VOUT) ; port Vcc_5V
12V: 12V.1 C19.1 C20.1 R15.1 U11.3(VIN) ; port Vcc_12
GND: C19.2 C20.2 C21.2 C22.2 C23.2 C24.2 C25.2 GND8.1 GND10.1 R17.2 R18.2 U11.1(GND) U12.2(GND)
buck_out: BUCK_OUT.1 C21.1 C22.1 C23.1 L1.2 R16.1 U12.1(VIN) U12.3(ON/~{OFF})
NetC18_1: C18.1 U11.6(BOOT)
NetC18_2: C18.2 L1.1 U11.2(SW)
NetC24_1: C24.1 U12.4(BYPASS)
NetR15_2: R15.2 R17.1 U11.5(EN)
NetR16_2: R16.2 R18.1 U11.4(FB)

### Notes on the sheet
- Vin = 12V
- Vout = 6V
- Vout = 5V
- Project Name:
- Company Confidential / Not for distribution!
- Document Name:
- Designer Name:
- Date/Time:
- Revision:

### Library data of the parts
12V BUCK_OUT GND8 GND10 LDO_OUT = TestPoint: Test Point
C18 C21 C22 C24 C25 = Capacitor: Dielectric: X7R; Volatge: 16; Manufacturer: *; Part Number: *
  C18: Value: 100n
  C21 C22: Value: 22u
  C24: Value: 10n
  C25: Value: 2.2u
C19 C20 = Capacitor: Dielectric: X7R; Volatge: 25; Manufacturer: *; Part Number: *
  C19: Value: 10u
  C20: Value: 100n
C23 = Capacitor: Dielectric: X7R; Voltage: 16V; Manufacturer: *; Part Number: *; Value: 4.7u
L1 = 46153C_inductor: Fixed Inductors 15uH 2.2A SMT; Manufacturer_Name: Murata Electronics; Geometry.Height: 4.55mm; TME Electronic Components Part Number: *; TME Electronic Components Price/Stock: *; Manufacturer_Part_Number: 46153C; Datasheet Link: https://search.murata.co.jp/Ceramy/image/img/P02A/kmp_4600.pdf
R15-R18 = Resistor: Manufacturer: *; Part Number: *; ComponentLink1Description: HelpURL; ComponentLink1URL: *
  R15: Value: 536k
  R16: Value: 100k
  R17: Value: 71.5k
  R18: Value: 11k
U11 = TPS54202HDDCR: IC REG BUCK ADJ 2A TSOT23-6; Min Output Voltage: 596mV; Number of Outputs: 1; Max Input Voltage: 28V; Switching Frequency: 500kHz; Output Configuration: Positive; Min Input Voltage: 4.5V; Synchronous Rectifier: Yes; Output Type: Adjustable; Quiescent Current: 40uA; Case/Package: SOT-23-6; Output Current: 2A; Mount: Surface Mount; Min Operating Temperature: -40°C; Max Output Voltage: 28V; Max Operating Temperature: 125°C; Lead Free: Lead Free; Packaging: Tape and Reel; RoHS Compliant: Yes
U12 = LP2985-50DBVRG4: Single Output Low Noise LDO, 150 mA, Fixed 5 V Output, 1.5% Tolerance, 2.2 to 16 V Input, Low IQ, 5-Pin SOT-23 (DBV), -40 to 125 degC, Green (RoHS & no Sb/Br), Tape and Reel; Manufacturer: Texas Instruments; Vdo (Typ) (mV): 280; Fixed Output Options (V): 5; Accuracy (%): 1.5; Output Options: Fixed Output; Iout (Max) (A): 0.15; Iq (Typ) (mA): 0.85; Packing: Tape and Reel; ComponentLink2URL: http://www.ti.com/lit/ds/symlink/lp2985-50.pdf; Vin (V): 2.2 to 16; ComponentLink3URL: http://www.ti.com/litv/pdf/mpds018j; Operating Temperature Range (degC): -40 to 125; ComponentLink3Description: Package Specification; ComponentLink1Description: Manufacturer URL; RoHS: TRUE; PackageReference: DBV0005A; PackageDescription: 5-Pin Plastic Small Outline, Body 2.9 x 1.6 mm, Pitch 0.95 mm; DatasheetVersion: SLVS522N; PackageVersion: 4073253-4/L; Mounting Technology: Surface Mount; ComponentLink1URL: http://www.ti.com/; PartNumber: LP2985-50DBVRG4; ComponentLink2Description: Datasheet

## Nets that join several sheets
5V: control_logic (17 pins), power_section (C25.1 LDO_OUT.1 U12.5)
12V: Top_TB (V1.1), top (POWER.1), output_stage (16 pins), power_section (5 pins)
GND: Top_TB (V1.2 V2.2 V3.2), top (GND7.1 INPUT.1 INPUT.4 POWER.2), control_logic (30 pins), output_stage (20 pins), power_section (13 pins)
AUDIO_CH_L: Top_TB (V2.1), top (A_L.1 INPUT.2), control_logic (C2.1)
AUDIO_CH_R: Top_TB (V3.1), top (A_R.1 INPUT.3), control_logic (C1.1)
DEAD_N: control_logic (DN.1 U8.6), output_stage (U13.7 U14.8)
DEAD_P: control_logic (DP.1 U8.4), output_stage (U13.8 U14.7)
NetC36_1: Top_TB (R19.2), top (OUTPUT.2), output_stage (C36.1 C37.1 L2.2 OUT_P.1)
NetC37_2: Top_TB (R19.1), top (OUTPUT.1), output_stage (C37.2 C38.2 L3.2 OUT_N.1)